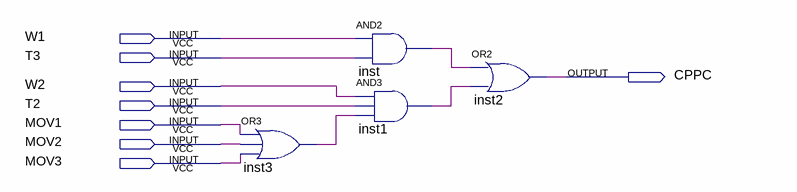
[diagram p0: schematic sheet]
// Quartus schematic CPPC.bdf as structural Verilog: 4 symbols, 8 pins
module CPPC (
  input  W1,
  input  T3,
  input  W2,
  input  T2,
  input  MOV1,
  input  MOV2,
  input  MOV3,
  output CPPC
);

  wire inst1_out, inst3_out, inst_out;

  or inst3 (inst3_out, MOV1, MOV2, MOV3);
  and inst (inst_out, W1, T3);
  and inst1 (inst1_out, W2, T2, inst3_out);
  or inst2 (CPPC, inst_out, inst1_out);
endmodule
